# Altium schematic sheet TitlePage.SchDoc
size A
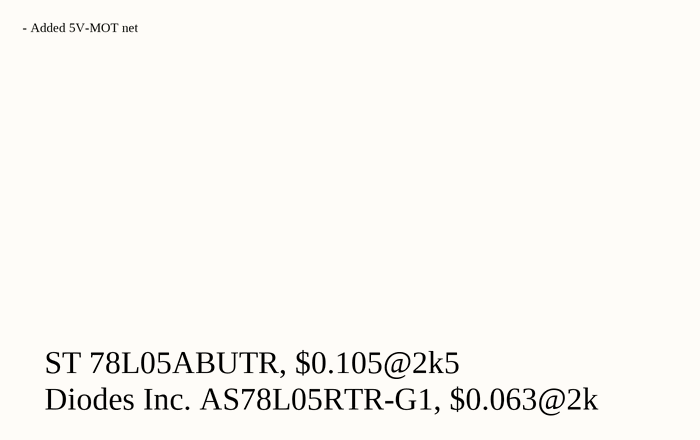
[diagram p0: TitlePage.SchDoc]

## Notes on the sheet
- - Added 5V-MOT net
- ST 78L05ABUTR, $0.105@2k5
- Diodes Inc. AS78L05RTR-G1, $0.063@2k